# EAGLE design businesscard_board (EAGLE 9.6.2)
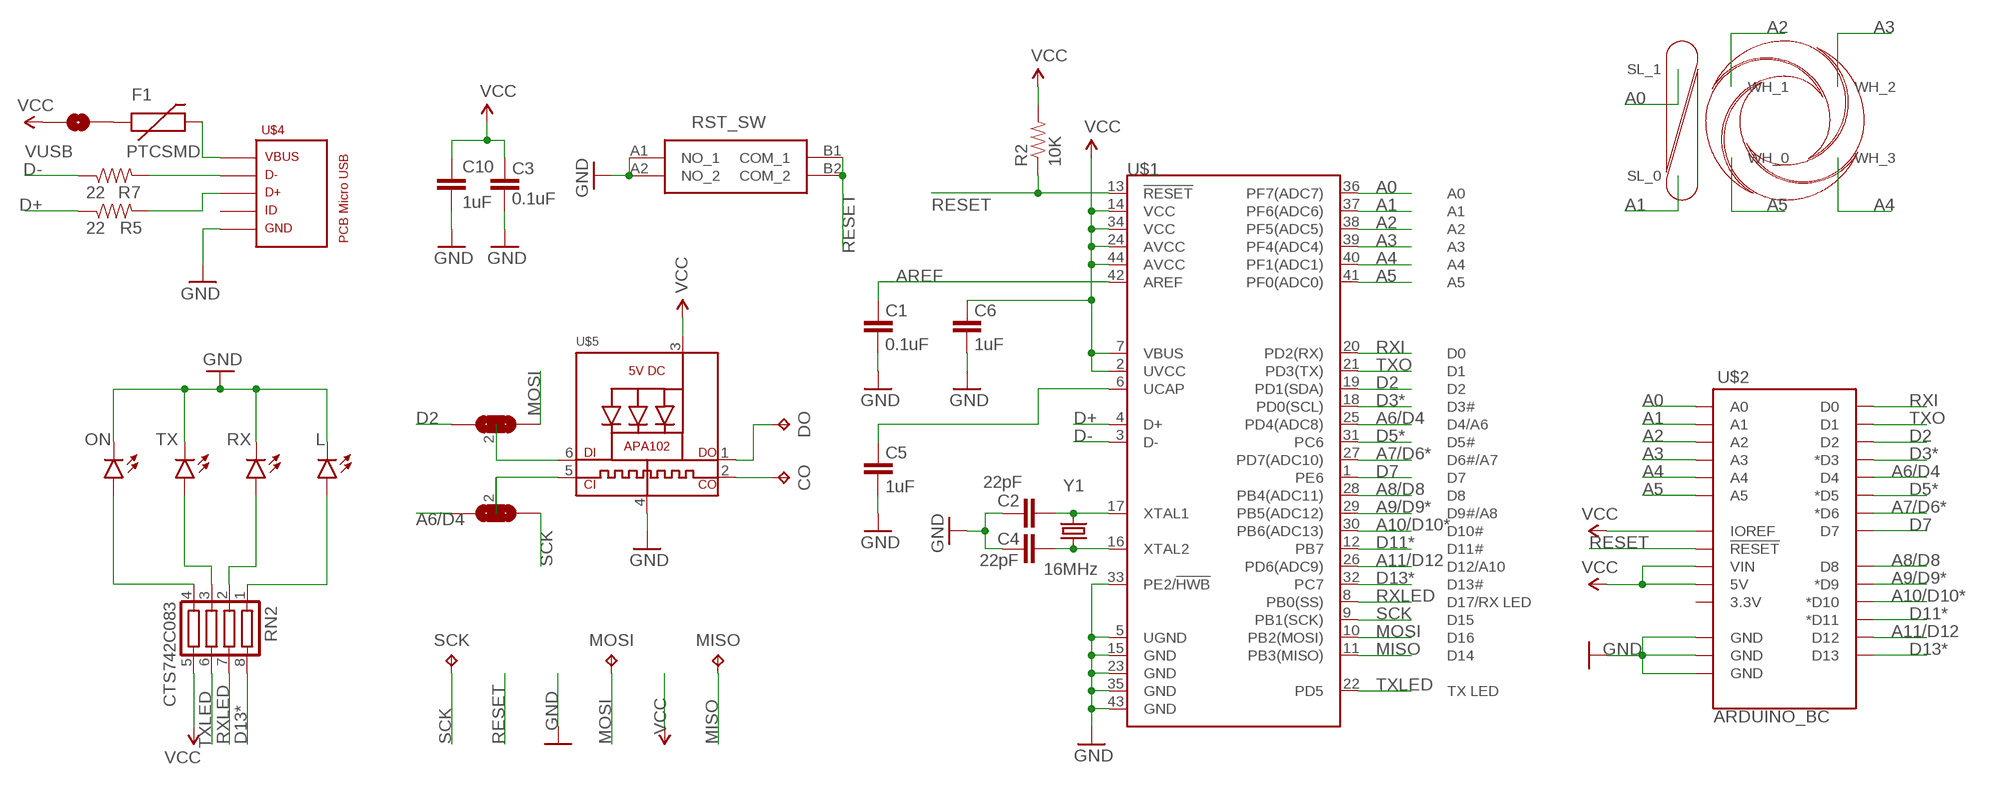
[diagram p0: schematic, sheet 1]

## Parts
C1  0.1uF  CAP0603-CAP  [0603-CAP]
C2  22pF  CAP0603-CAP  [0603-CAP]
C3  0.1uF  CAP0603-CAP  [0603-CAP]
C4  22pF  CAP0603-CAP  [0603-CAP]
C5  1uF  CAP0603-CAP  [0603-CAP]
C6  1uF  CAP0603-CAP  [0603-CAP]
C10  1uF  CAP0603-CAP  [0603-CAP]
CO  TPTP12R  [TP12R]
D2-/-°-MOSI  SOLDER_JP_3WAY  [SOLDER_JP_3WAY]
D4-/-°-SCK  SOLDER_JP_3WAY  [SOLDER_JP_3WAY]
DO  TPTP12R  [TP12R]
F1  PTCSMD  [PTC-1206]
L  LED  [LED-0603_NOMARKER]
MISO  TPTP12R  [TP12R]
MOSI  TPTP12R  [TP12R]
ON  LED  [LED-0603_NOMARKER]
R2  10K  RESISTOR0603-RES  [0603-RES]
R5  22  RESISTOR0603-RES  [0603-RES]
R7  22  RESISTOR0603-RES  [0603-RES]
RN2  CTS742C083  [CTS742C083]
RST_SW  EVP-BB0AAB000  [EVPBB0AAB000]
RX  LED  [LED-0603_NOMARKER]
SCK  TPTP12R  [TP12R]
TX  LED  [LED-0603_NOMARKER]
U$1  32U4  ATMEGA32U4  [TQFP44_QRCODE]
U$2  ARDUINO_BC  [ARDUINO_BC_SINGLEROWS]
U$3  TOUCH_SENSORS  [TOUCH_SENSORS]
U$4  PCB_MICRO_USB_B  [USB_TYPE_B_SS_2_NO_DIMENSION]
U$5  APA1022020  [APA102_2020]
VUSB  SOLDER_JP  [SOLDER_JP]
Y1  16MHz  CRYSTAL5X3  [CRYSTAL-SMD-5X3]

## Nets
A0 [vcc]: U$1.36(PF7(ADC7)) U$2.A0 U$3.SLIDER_1(SL_1)
A1: U$1.37(PF6(ADC6)) U$2.A1 U$3.SLIDER_0(SL_0)
A2: U$1.38(PF5(ADC5)) U$2.A2 U$3.WHEEL_1(WH_1)
A3: U$1.39(PF4(ADC4)) U$2.A3 U$3.WHEEL_2(WH_2)
A4: U$1.40(PF1(ADC1)) U$2.A4 U$3.WHEEL_3(WH_3)
A5: U$1.41(PF0(ADC0)) U$2.A5 U$3.WHEEL_0(WH_0)
A6/D4: D4-/-°-SCK.3(DIS) U$1.25(PD4(ADC8)) U$2.D4
A7/D6*: U$1.27(PD7(ADC10)) U$2.D6(*D6)
A8/D8: U$1.28(PB4(ADC11)) U$2.D8
A9/D9*: U$1.29(PB5(ADC12)) U$2.D9(*D9)
A10/D10*: U$1.30(PB6(ADC13)) U$2.D10(*D10)
A11/D12: U$1.26(PD6(ADC9)) U$2.D12
APA102_CI: D4-/-°-SCK.2(MID) U$5.5(CKI)
APA102_CO: CO.TP U$5.2(CKO)
APA102_DO: DO.TP U$5.1(DO)
AREF: C1.2 U$1.42(AREF)
D2: D2-/-°-MOSI.3(DIS) U$1.19(PD1(SDA)) U$2.D2
D3*: U$1.18(PD0(SCL)) U$2.D3(*D3)
D5*: U$1.31(PC6) U$2.D5(*D5)
D7: U$1.1(PE6) U$2.D7
D11*: U$1.12(PB7) U$2.D11(*D11)
D13*: RN2.8 U$1.32(PC7) U$2.D13
D+: R5.1 U$1.4(D+)
D-: R7.1 U$1.3(D-)
GND [vcc]: C1.1 C2.2 C3.1 C4.2 C5.1 C6.1 C10.2 L.C ON.C RST_SW.A1(NO_1) RST_SW.A2(NO_2) RX.C TX.C U$1.5(UGND) U$1.15(GND) U$1.23(GND) U$1.33(PE2/!HWB) U$1.35(GND) U$1.43(GND) U$2.GND@1(GND) U$2.GND@2(GND) U$2.GND@3(GND) U$4.5 U$5.4(GND)
MISO: MISO.TP U$1.11(PB3(MISO))
MOSI: D2-/-°-MOSI.1(CON) MOSI.TP U$1.10(PB2(MOSI))
N$1: ON.A RN2.4
N$2: RN2.3 TX.A
N$3: L.A RN2.1
N$4: RN2.2 RX.A
N$5: F1.1 VUSB.2
N$6: D2-/-°-MOSI.2(MID) U$5.6(DI)
N$13: C4.1 U$1.16(XTAL2) Y1.1
N$14: C2.1 U$1.17(XTAL1) Y1.3
N$15: C5.2 U$1.6(UCAP)
N$18: R7.2 U$4.2
N$19: R5.2 U$4.3
RESET: R2.1 RST_SW.B1(COM_1) RST_SW.B2(COM_2) U$1.13(!RESET) U$2.RESET@1(!RESET!)
RXI: U$1.20(PD2(RX)) U$2.D0
RXLED: RN2.7 U$1.8(PB0(SS))
SCK: D4-/-°-SCK.1(CON) SCK.TP U$1.9(PB1(SCK))
TXLED: RN2.6 U$1.22(PD5)
TXO: U$1.21(PD3(TX)) U$2.D1
USB_PWR: F1.2 U$4.1
VCC: C3.2 C6.2 C10.1 R2.2 RN2.5 U$1.2(UVCC) U$1.7(VBUS) U$1.14(VCC) U$1.24(AVCC) U$1.34(VCC) U$1.44(AVCC) U$2.5V U$2.5V@2(VIN) U$2.IOREF U$5.3(VDD) VUSB.1
Unconnected: U$2.NC(3.3V) U$2.NC@2(3.3V) U$4.4

## Library data of the parts
C1-C6 C10 = businesscard_board:CAP: Capacitor Standard 0603 ceramic capacitor, and 0.1" leaded capacitor.
CO DO MISO MOSI SCK = businesscard_board:TP: Test pad
D2-/-°-MOSI D4-/-°-SCK = businesscard_board:SOLDER_JP_3WAY
F1 = businesscard_board:PTC: Resettable Fuse PTC Resettable Fuse. Spark Fun Electronics SKU : COM-08357
L ON RX TX = businesscard_board:LED: LED (Generic) Standard schematic elements and footprints for 5mm, 3mm, 1206, and 0603 sized LEDs. Generic LEDs with no color specified.; PROD_ID: DIO-08794
R2 R5 R7 = businesscard_board:RESISTOR: Resistor Basic schematic elements and footprints for 0603, 1206, and PTH resistors.
RN2 = businesscard_board:CTS742C083: Chip Resistor Array 4 Single Resistor Source: http://www.ctscorp.com/components/Datasheets/CTSChipArrayDs.pdf; OC_FARNELL: unknown; OC_NEWARK: unknown
RST_SW = businesscard_board:EVP-BB0AAB000: Tactile Switches 2.6x1.6x0.5mm 0.7N 0.08mm Travel Source: Datasheet <https://componentsearchengine.com/Datasheets/1/EVP-BB0AAB000.pdf>; DESCRIPTION: Tactile Switches 2.6x1.6x0.5mm 0.7N 0.08mm Travel; HEIGHT: 0.6mm; MANUFACTURER_NAME: Panasonic; MANUFACTURER_PART_NUMBER: EVP-BB0AAB000; MOUSER_PART_NUMBER: 667-EVP-BB0AAB000; MOUSER_PRICE-STOCK: https://www.mouser.com/Search/Refine.aspx?Keyword=667-EVP-BB0AAB000
U$1 = businesscard_board:ATMEGA32U4: Atmel MCU, 32KByte Atmel 44-pin 8-bit Microcontroller with 32KBytes of ISP Flash and USB Controller Datasheet <http://cdn.sparkfun.com/datasheets/Dev/Arduino/Boards/ATMega32U4.pdf> SparkFun Products LilyPad Arduino USB - ATmega32U4 Board <https://www.sparkfun.com/products/12049> (DEV-12049) Pro Micro - 5V/16MHz <https://www.sparkfun.com/products/12640> (DEV-12640) Pro Micro - 3.3V/8MHz <https://www.sparkfun.com/products/12587> (DEV-12587) Fio v3 - ATmega32U4 <https://www.sparkfun.com/products/11520> (DEV-11520) Qduino Mini <https://www.sparkfun.com/products/13614> (DEV-13614) Makey Makey - Standard Kit <https://www.sparkfun.com/products/11511> (WIG-11511) Makey Makey Deluxe Kit <https://www.sparkfun.com/products/11519> (WIG-11519); PROD_ID: IC-11161
U$2 = businesscard_board:ARDUINO_BC
U$3 = businesscard_board:TOUCH_SENSORS
U$4 = businesscard_board:PCB_MICRO_USB_B
U$5 = businesscard_board:APA102: APA102/DotStar Pixels VCC: 5V DC Refresh Rate: 400Hz
VUSB = businesscard_board:SOLDER_JP
Y1 = businesscard_board:CRYSTAL: Crystals Various standard crystals. Proven footprints. Spark Fun Electronics SKU : COM-00534

## Board
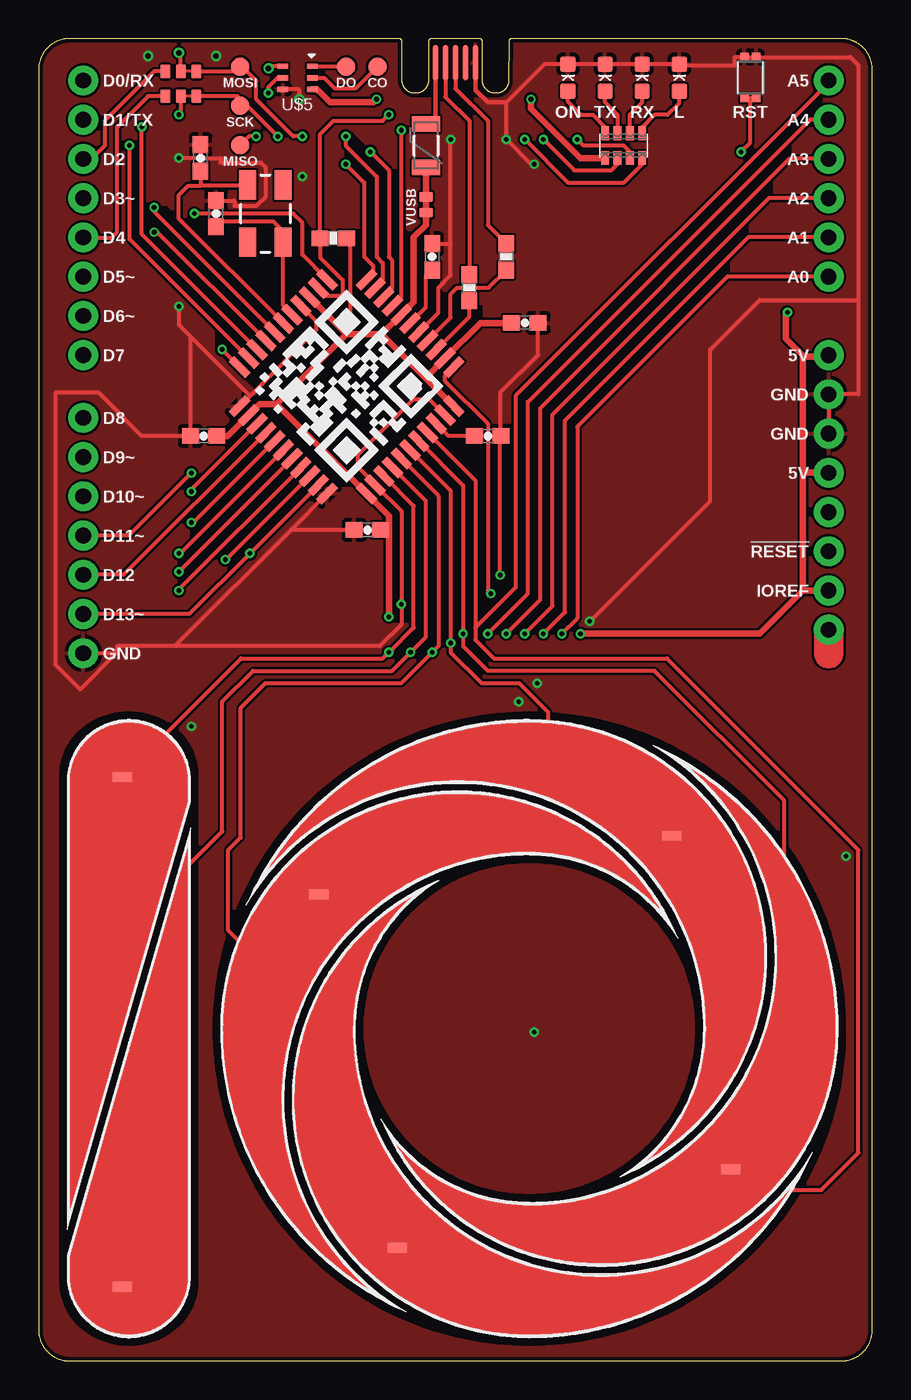
[diagram p1: board, top side]
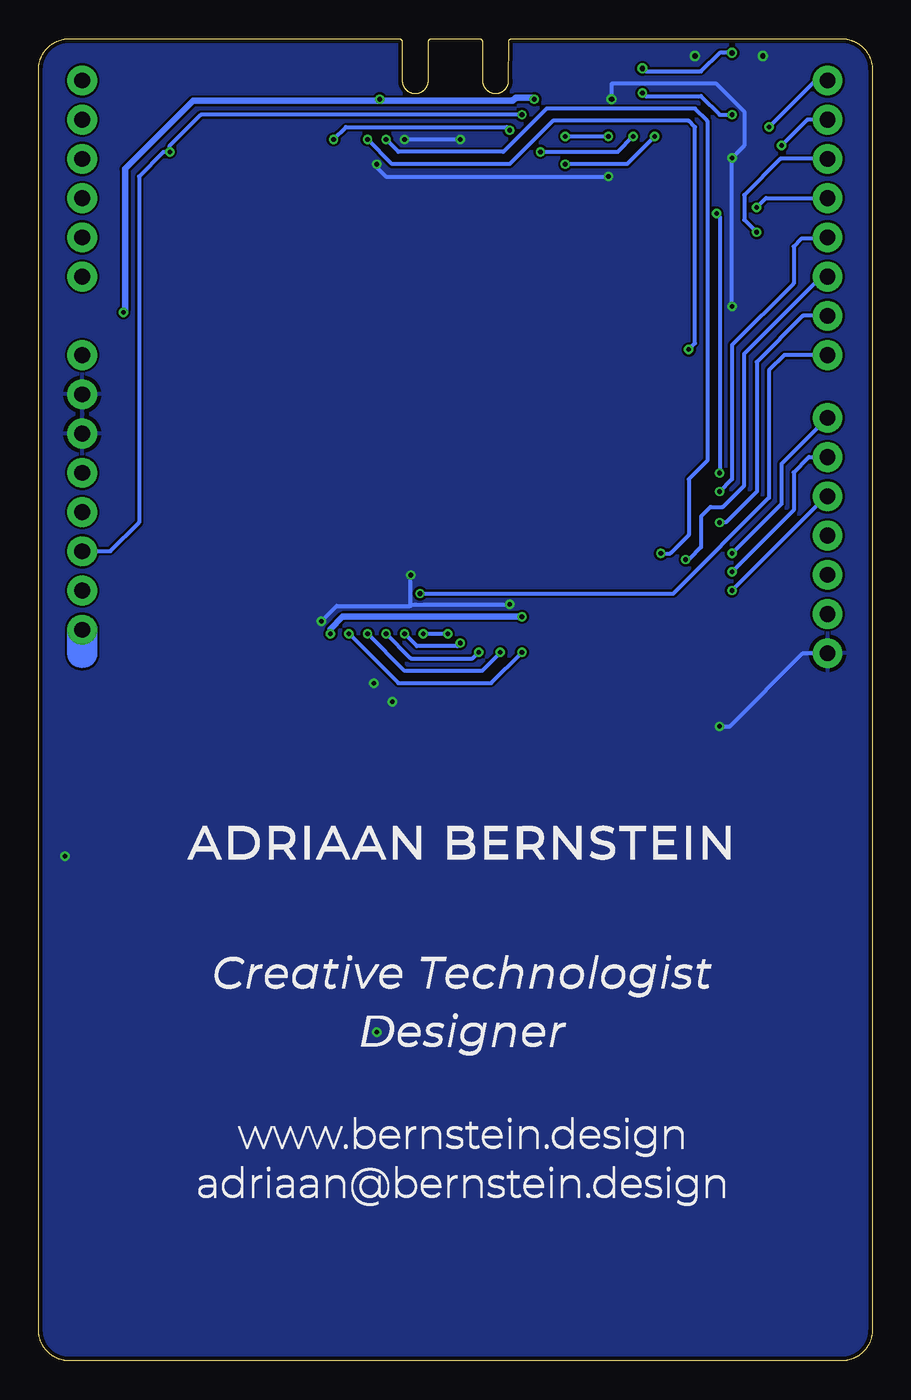
[diagram p2: board, bottom side, seen from below]

Size 53.98 x 85.6 mm. Coordinates in mm from the lower left corner, seen from the top.
Outline: 51.98,85.6 30.63,85.6 30.63,85.6 30.62,85.6 30.62,85.6 30.61,85.6 30.61,85.6 30.6,85.6 30.6,85.6 30.59,85.59 30.59,85.59 30.58,85.59 30.58,85.59 30.58,85.59 30.57,85.59 30.57,85.59 30.56,85.58 30.56,85.58 30.55,85.58 30.55,85.58 30.54,85.58 30.54,85.57 30.54,85.57 30.53,85.57 30.53,85.57 30.52,85.56 30.52,85.56 30.52,85.56 30.51,85.55 30.51,85.55 30.51,85.55 30.5,85.54 30.5,85.54 30.49,85.54 30.49,85.53 30.49,85.53 30.49,85.53 30.48,85.52 30.48,85.52 30.48,85.52 30.47,85.51 30.47,85.51 30.47,85.5 30.47,85.5 30.46,85.49 30.46,85.49 30.46,85.49 30.46,85.48 30.46,85.48 30.45,85.47 30.45,85.47 30.45,85.46 30.45,85.46 30.45,85.45 30.45,85.45 30.44,85.44 30.44,85.44 30.44,85.43 30.44,85.43 30.44,85.42 30.44,85.42 30.44,85.41 30.44,85.41 30.44,85.4 30.44,82.88 30.44,82.86 30.44,82.83 30.44,82.81 30.43,82.79 30.43,82.77 30.43,82.75 30.42,82.73 30.42,82.71 30.41,82.69 30.41,82.67 30.4,82.65 30.39,82.63 30.39,82.61 30.38,82.59 30.37,82.57 30.36,82.55 30.36,82.53 30.35,82.51 30.34,82.49 30.33,82.48 30.32,82.46 30.31,82.44 30.29,82.42 30.28,82.41 30.27,82.39 30.26,82.37 30.25,82.36 30.23,82.34 30.22,82.33 30.2,82.31 30.19,82.3 30.18,82.28 30.16,82.27 30.15,82.26 30.13,82.24 30.11,82.23 30.1,82.22 30.08,82.21 30.06,82.19 30.05,82.18 30.03,82.17 30.01,82.16 29.99,82.15 29.98,82.14 29.96,82.13 29.94,82.12 29.92,82.12 29.9,82.11 29.88,82.1 29.86,82.09 29.84,82.09 29.82,82.08 29.8,82.08 29.78,82.07 29.76,82.07 29.74,82.06 29.72,82.06 29.7,82.06 29.68,82.05 29.65,82.05 29.63,82.05 29.61,82.05 29.59,82.05 29.57,82.05 29.55,82.05 29.52,82.05 29.5,82.05 29.48,82.06 29.46,82.06 29.44,82.06 29.42,82.07 29.4,82.07 29.38,82.08 29.36,82.08 29.34,82.09 29.32,82.09 29.3,82.1 29.28,82.11 29.26,82.12 29.24,82.12 29.22,82.13 29.2,82.14 29.18,82.15 29.17,82.16 29.15,82.17 29.13,82.18 29.11,82.19 29.1,82.21 29.08,82.22 29.06,82.23 29.05,82.24 29.03,82.26 29.02,82.27 29,82.28 28.99,82.3 28.97,82.31 28.96,82.33 28.95,82.34 28.93,82.36 28.92,82.37 28.91,82.39 28.9,82.41 28.88,82.42 28.87,82.44 28.86,82.46 28.85,82.48 28.84,82.49 28.83,82.51 28.82,82.53 28.81,82.55 28.81,82.57 28.8,82.59 28.79,82.61 28.78,82.63 28.78,82.65 28.77,82.67 28.77,82.69 28.76,82.71 28.76,82.73 28.75,82.75 28.75,82.77 28.75,82.79 28.74,82.81 28.74,82.83 28.74,82.86 28.74,82.88 28.74,85.4 28.74,85.41 28.74,85.41 28.74,85.42 28.74,85.42 28.74,85.43 28.74,85.43 28.74,85.44 28.73,85.44 28.73,85.45 28.73,85.45 28.73,85.46 28.73,85.46 28.73,85.47 28.73,85.47 28.72,85.48 28.72,85.48 28.72,85.49 28.72,85.49 28.72,85.49 28.71,85.5 28.71,85.5 28.71,85.51 28.71,85.51 28.7,85.52 28.7,85.52 28.7,85.52 28.69,85.53 28.69,85.53 28.69,85.53 28.68,85.54 28.68,85.54 28.68,85.54 28.67,85.55 28.67,85.55 28.67,85.55 28.66,85.56 28.66,85.56 28.66,85.56 28.65,85.57 28.65,85.57 28.64,85.57 28.64,85.57 28.63,85.58 28.63,85.58 28.63,85.58 28.62,85.58 28.62,85.58 28.61,85.59 28.61,85.59 28.6,85.59 28.6,85.59 28.59,85.59 28.59,85.59 28.58,85.59 28.58,85.6 28.57,85.6 28.57,85.6 28.57,85.6 28.56,85.6 28.55,85.6 28.55,85.6 28.54,85.6 25.43,85.6 25.43,85.6 25.42,85.6 25.42,85.6 25.41,85.6 25.41,85.6 25.4,85.6 25.4,85.6 25.39,85.59 25.39,85.59 25.38,85.59 25.38,85.59 25.38,85.59 25.37,85.59 25.37,85.59 25.36,85.58 25.36,85.58 25.35,85.58 25.35,85.58 25.34,85.58 25.34,85.57 25.34,85.57 25.33,85.57 25.33,85.57 25.32,85.56 25.32,85.56 25.32,85.56 25.31,85.55 25.31,85.55 25.31,85.55 25.3,85.54 25.3,85.54 25.29,85.54 25.29,85.53 25.29,85.53 25.29,85.53 25.28,85.52 25.28,85.52 25.28,85.52 25.27,85.51 25.27,85.51 25.27,85.5 25.27,85.5 25.26,85.49 25.26,85.49 25.26,85.49 25.26,85.48 25.26,85.48 25.25,85.47 25.25,85.47 25.25,85.46 25.25,85.46 25.25,85.45 25.25,85.45 25.24,85.44 25.24,85.44 25.24,85.43 25.24,85.43 25.24,85.42 25.24,85.42 25.24,85.41 25.24,85.41 25.24,85.4 25.24,82.88 25.24,82.86 25.24,82.83 25.24,82.81 25.23,82.79 25.23,82.77 25.23,82.75 25.22,82.73 25.22,82.71 25.21,82.69 25.21,82.67 25.2,82.65 25.19,82.63 25.19,82.61 25.18,82.59 25.17,82.57 25.16,82.55 25.16,82.53 25.15,82.51 25.14,82.49 25.13,82.48 25.12,82.46 25.11,82.44 25.09,82.42 25.08,82.41 25.07,82.39 25.06,82.37 25.05,82.36 25.03,82.34 25.02,82.33 25,82.31 24.99,82.3 24.98,82.28 24.96,82.27 24.95,82.26 24.93,82.24 24.91,82.23 24.9,82.22 24.88,82.21 24.86,82.19 24.85,82.18 24.83,82.17 24.81,82.16 24.79,82.15 24.78,82.14 24.76,82.13 24.74,82.12 24.72,82.12 24.7,82.11 24.68,82.1 24.66,82.09 24.64,82.09 24.62,82.08 24.6,82.08 24.58,82.07 24.56,82.07 24.54,82.06 24.52,82.06 24.5,82.06 24.48,82.05 24.45,82.05 24.43,82.05 24.41,82.05 24.39,82.05 24.37,82.05 24.35,82.05 24.32,82.05 24.3,82.05 24.28,82.06 24.26,82.06 24.24,82.06 24.22,82.07 24.2,82.07 24.18,82.08 24.16,82.08 24.14,82.09 24.12,82.09 24.1,82.1 24.08,82.11 24.06,82.12 24.04,82.12 24.02,82.13 24,82.14 23.98,82.15 23.97,82.16 23.95,82.17 23.93,82.18 23.91,82.19 23.9,82.21 23.88,82.22 23.86,82.23 23.85,82.24 23.83,82.26 23.82,82.27 23.8,82.28 23.79,82.3 23.77,82.31 23.76,82.33 23.75,82.34 23.73,82.36 23.72,82.37 23.71,82.39 23.7,82.41 23.68,82.42 23.67,82.44 23.66,82.46 23.65,82.48 23.64,82.49 23.63,82.51 23.62,82.53 23.61,82.55 23.61,82.57 23.6,82.59 23.59,82.61 23.58,82.63 23.58,82.65 23.57,82.67 23.57,82.69 23.56,82.71 23.56,82.73 23.55,82.75 23.55,82.77 23.55,82.79 23.54,82.81 23.54,82.83 23.54,82.86 23.54,82.88 23.54,85.4 23.54,85.41 23.54,85.41 23.54,85.42 23.54,85.42 23.54,85.43 23.54,85.43 23.54,85.44 23.53,85.44 23.53,85.45 23.53,85.45 23.53,85.46 23.53,85.46 23.53,85.47 23.53,85.47 23.52,85.48 23.52,85.48 23.52,85.49 23.52,85.49 23.52,85.49 23.51,85.5 23.51,85.5 23.51,85.51 23.51,85.51 23.5,85.52 23.5,85.52 23.5,85.52 23.49,85.53 23.49,85.53 23.49,85.53 23.48,85.54 23.48,85.54 23.48,85.54 23.47,85.55 23.47,85.55 23.47,85.55 23.46,85.56 23.46,85.56 23.46,85.56 23.45,85.57 23.45,85.57 23.44,85.57 23.44,85.57 23.43,85.58 23.43,85.58 23.43,85.58 23.42,85.58 23.42,85.58 23.41,85.59 23.41,85.59 23.4,85.59 23.4,85.59 23.39,85.59 23.39,85.59 23.38,85.59 23.38,85.6 23.37,85.6 23.37,85.6 23.37,85.6 23.36,85.6 23.35,85.6 23.35,85.6 23.34,85.6 1.95,85.6 1.9,85.6 1.85,85.59 1.8,85.59 1.74,85.58 1.69,85.58 1.65,85.57 1.6,85.56 1.55,85.55 1.5,85.54 1.45,85.52 1.4,85.51 1.36,85.49 1.31,85.48 1.27,85.46 1.22,85.44 1.18,85.42 1.13,85.4 1.09,85.38 1.05,85.36 1,85.33 0.96,85.31 0.92,85.28 0.88,85.26 0.84,85.23 0.8,85.2 0.76,85.17 0.73,85.14 0.69,85.11 0.65,85.08 0.62,85.05 0.59,85.01 0.55,84.98 0.52,84.94 0.49,84.91 0.46,84.87 0.43,84.83 0.4,84.8 0.37,84.76 0.34,84.72 0.31,84.68 0.29,84.64 0.26,84.59 0.24,84.55 0.22,84.51 0.2,84.47 0.18,84.42 0.16,84.38 0.14,84.33 0.12,84.29 0.1,84.24 0.09,84.19 0.08,84.15 0.06,84.1 0.05,84.05 0.04,84 0.03,83.95 0.02,83.9 0.02,83.85 0.01,83.8 0.01,83.75 0,83.7 0,83.65 0,1.95 0,1.9 0.01,1.85 0.01,1.79 0.02,1.74 0.02,1.69 0.03,1.65 0.04,1.6 0.05,1.55 0.06,1.5 0.08,1.45 0.09,1.4 0.1,1.36 0.12,1.31 0.14,1.27 0.16,1.22 0.18,1.18 0.2,1.13 0.22,1.09 0.24,1.05 0.26,1 0.29,0.96 0.31,0.92 0.34,0.88 0.37,0.84 0.4,0.8 0.43,0.76 0.46,0.73 0.49,0.69 0.52,0.65 0.55,0.62 0.59,0.59 0.62,0.55 0.65,0.52 0.69,0.49 0.73,0.46 0.76,0.43 0.8,0.4 0.84,0.37 0.88,0.34 0.92,0.31 0.96,0.29 1,0.26 1.05,0.24 1.09,0.22 1.13,0.2 1.18,0.18 1.22,0.16 1.27,0.14 1.31,0.12 1.36,0.1 1.4,0.09 1.45,0.08 1.5,0.06 1.55,0.05 1.6,0.04 1.65,0.03 1.69,0.02 1.74,0.02 1.8,0.01 1.85,0.01 1.9,0 1.95,0 52.03,0 52.08,0 52.13,0.01 52.18,0.01 52.23,0.02 52.28,0.02 52.33,0.03 52.38,0.04 52.43,0.05 52.48,0.06 52.53,0.08 52.57,0.09 52.62,0.1 52.67,0.12 52.71,0.14 52.76,0.16 52.8,0.18 52.85,0.2 52.89,0.22 52.93,0.24 52.98,0.26 53.02,0.29 53.06,0.31 53.1,0.34 53.14,0.37 53.18,0.4 53.21,0.43 53.25,0.46 53.29,0.49 53.32,0.52 53.36,0.55 53.39,0.59 53.43,0.62 53.46,0.65 53.49,0.69 53.52,0.73 53.55,0.76 53.58,0.8 53.61,0.84 53.64,0.88 53.66,0.92 53.69,0.96 53.71,1 53.74,1.05 53.76,1.09 53.78,1.13 53.8,1.18 53.82,1.22 53.84,1.27 53.86,1.31 53.87,1.36 53.89,1.4 53.9,1.45 53.92,1.5 53.93,1.55 53.94,1.6 53.95,1.65 53.96,1.69 53.96,1.74 53.97,1.79 53.97,1.85 53.98,1.9 53.98,1.95 53.98,83.65 53.98,83.7 53.97,83.75 53.97,83.8 53.96,83.85 53.96,83.9 53.95,83.95 53.94,84 53.93,84.05 53.92,84.1 53.9,84.15 53.89,84.19 53.87,84.24 53.86,84.29 53.84,84.33 53.82,84.38 53.8,84.42 53.78,84.47 53.76,84.51 53.74,84.55 53.71,84.59 53.69,84.64 53.66,84.68 53.64,84.72 53.61,84.76 53.58,84.8 53.55,84.83 53.52,84.87 53.49,84.91 53.46,84.94 53.43,84.98 53.39,85.01 53.36,85.05 53.32,85.08 53.29,85.11 53.25,85.14 53.21,85.17 53.18,85.2 53.14,85.23 53.1,85.26 53.06,85.28 53.02,85.31 52.98,85.33 52.93,85.36 52.89,85.38 52.85,85.4 52.8,85.42 52.76,85.44 52.71,85.46 52.67,85.48 52.62,85.49 52.57,85.51 52.53,85.52 52.48,85.54 52.43,85.55 52.38,85.56 52.33,85.57 52.28,85.58 52.23,85.58 52.18,85.59 52.13,85.59 52.08,85.6 52.03,85.6 51.98,85.6
Copper layers (1*16): Top 0.035mm / dielectric 1.5mm / Bottom 0.035mm
Design rules "default *": minimum track width 6mil, minimum drill 0.3mm, track to track 0.145796875mm, track to pad 0.145796875mm, pad to pad 0.145796875mm, via to via 0.145796875mm, smd to smd 0mil, copper to edge 10mil, drill to drill 6mil, minimum pad ring 10mil, minimum via ring 6mil, stop-mask expansion 2mil, vias tented up to drill 24mil, thermal gap 10mil
tRestrict: area 6.7,45.9 to 29.1,74.7; area 27.5,47.1 to 50.7,82.3; area 24.3,81.9 to 29.5,83.1; area 24.3,69.1 to 25.9,72.7; area 17.1,70.3 to 24.3,79.5

### Footprints (pad centres in the part's own frame; a part is rotated, then mirrored left to right if it is on the bottom)
0603-CAP = smd 1.1 x 1: 1 -0.85,0; 2 0.85,0
TP12R = smd 1.2 x 1.2: TP 0,0
SOLDER_JP_3WAY = smd 0.635 x 0.889: 1 -1.143,0; 2 -0.127,0; 3 0.873,0
PTC-1206 = smd 1 x 1.8: 1 -1.4,0; 2 1.4,0
LED-0603_NOMARKER = smd 1 x 1: A -0.877,0; C 0.877,0
0603-RES = smd 1.1 x 1: 1 -0.85,0; 2 0.85,0
CTS742C083 = smd 0.5 x 0.9: 1 -1.2,-0.8; 2 -0.4,-0.8; 3 0.4,-0.8; 4 1.2,-0.8; 5 1.2,0.8; 6 0.4,0.8; 7 -0.4,0.8; 8 -1.2,0.8
EVPBB0AAB000 = smd 0.55 x 0.55: A1 -1.325,0.375; A2 -1.325,-0.375; B1 1.325,0.375; B2 1.325,-0.375
TQFP44_QRCODE = smd 1.5 x 0.5: 1 -5.8,4; 2 -5.8,3.2; 3 -5.8,2.4; 4 -5.8,1.6; 5 -5.8,0.8; 6 -5.8,0; 7 -5.8,-0.8; 8 -5.8,-1.6; 9 -5.8,-2.4; 10 -5.8,-3.2; 11 -5.8,-4; 23 5.8,-4; 24 5.8,-3.2; 25 5.8,-2.4; 26 5.8,-1.6; 27 5.8,-0.8; 28 5.8,0; 29 5.8,0.8; 30 5.8,1.6; 31 5.8,2.4; 32 5.8,3.2; 33 5.8,4 | smd 0.5 x 1.5: 12 -4,-5.8; 13 -3.2,-5.8; 14 -2.4,-5.8; 15 -1.6,-5.8; 16 -0.8,-5.8; 17 0,-5.8; 18 0.8,-5.8; 19 1.6,-5.8; 20 2.4,-5.8; 21 3.2,-5.8; 22 4,-5.8; 34 4,5.8; 35 3.2,5.8; 36 2.4,5.8; 37 1.6,5.8; 38 0.8,5.8; 39 0,5.8; 40 -0.8,5.8; 41 -1.6,5.8; 42 -2.4,5.8; 43 -3.2,5.8; 44 -4,5.8
ARDUINO_BC_SINGLEROWS = drill 1.016 pad 1.93: 5V 3.81,-24.13; 5V@2 11.43,-24.13; A0 16.51,-24.13; A1 19.05,-24.13; A2 21.59,-24.13; A3 24.13,-24.13; A4 26.67,-24.13; A5 29.21,-24.13; D0 29.21,24.13; D1 26.67,24.13; D2 24.13,24.13; D3 21.59,24.13; D4 19.05,24.13; D5 16.51,24.13; D6 13.97,24.13; D7 11.43,24.13; D8 7.366,24.13; D9 4.826,24.13; D10 2.286,24.13; D11 -0.254,24.13; D12 -2.794,24.13; D13 -5.334,24.13; GND@1 6.35,-24.13; GND@2 8.89,-24.13; GND@3 -7.874,24.13; IOREF -3.81,-24.13; NC -6.35,-24.13; NC@2 1.27,-24.13; RESET@1 -1.27,-24.13
TOUCH_SENSORS = smd 1.27 x 0.635: SLIDER_0 -26.67,-16.51; SLIDER_1 -26.67,16.51; WHEEL_0 -8.89,-13.97; WHEEL_1 -13.97,8.89; WHEEL_2 8.89,12.7; WHEEL_3 12.7,-8.89
USB_TYPE_B_SS_2_NO_DIMENSION = smd 0.37 x 2.3: 1 -1.3,-1.55; 2 -0.65,-1.55; 3 0,-1.55; 4 0.65,-1.55; 5 1.3,-1.55
APA102_2020 = smd 0.7 x 0.35: 1 -0.95,-0.75; 2 -0.95,0; 3 -0.95,0.75; 4 0.95,0.75; 5 0.95,0; 6 0.95,-0.75
SOLDER_JP = smd 0.635 x 0.889: 1 -1.143,0; 2 -0.127,0
CRYSTAL-SMD-5X3 = smd 1.9 x 1.1: 1 -1.85,-1.15; 2 1.85,-1.15; 3 1.85,1.15; 4 -1.85,1.15

### Placement (x,y rotation side)
C1  29.08,59.87 180 top
C2  10.48,77.87 90 top
C3  10.68,59.87 0 top
C4  11.48,74.27 90 top
C5  25.48,71.47 270 top
C6  21.28,53.8 0 top
C10  31.48,67.2 0 top
CO  21.94,83.78 90 top
D2-/-°-MOSI  9.08,83.47 180 top
D4-/-°-SCK  9.08,81.87 180 top
DO  19.91,83.78 90 top
F1  25.08,78.67 90 top
L  41.48,83.07 90 top
MISO  13.05,78.7 90 top
MOSI  13.05,83.78 90 top
ON  34.28,83.07 90 top
R2  19.08,72.67 0 top
R5  30.28,71.47 90 top
R7  27.88,69.47 90 top
RN2  37.88,78.67 180 top
RST_SW  46.08,83.07 270 top
RX  39.08,83.07 90 top
SCK  13.05,81.24 90 top
TX  36.68,83.07 90 top
U$1  19.95,63.07 225 top
U$2  27.02,53.68 90 top
U$3  32.1,21.3 0 top
U$4  26.99,85.59 0 top
U$5  16.77,83.06 180 top
VUSB  25.08,75.47 90 top
Y1  14.68,74.27 90 top

### Tracks (layer width: path | path; a pad name or v marks a point on that pad's centre or on a via)
A0  (via drill 0.3 pad 0.6)
  Top 0.254: U$1.36 24.28,55.34 24.28,47.47 v22.68,45.87 22.28,45.47 13.1,45.47 U$3.SLIDER_1 | v33.88,47.07 34.88,48.07 34.88,60.47 44.6,70.19 U$2.A0
  Bottom 0.254: v33.88,47.07 30.68,43.87 24.68,43.87 v22.68,45.87
A1  (via drill 0.3 pad 0.6)
  Top 0.254: U$3.SLIDER_0 8.68,8.04 8.68,29.07 9.48,29.87 9.48,31.87 11.88,34.27 11.88,42.67 13.88,44.67 22.88,44.67 v24.08,45.87 25.08,46.87 25.08,55.68 U$1.37 | v32.68,47.07 34.08,48.47 34.08,60.87 45.94,72.73 U$2.A1
  Bottom 0.254: v32.68,47.07 30.28,44.67 25.28,44.67 v24.08,45.87
A2  (via drill 0.3 pad 0.6)
  Top 0.254: U$3.WHEEL_1 14.68,26.74 14.68,26.67 13.48,26.67 12.28,27.87 12.28,33.07 13.08,33.87 13.08,42.27 14.68,43.87 23.48,43.87 v25.48,45.87 25.88,46.27 25.88,56.01 U$1.38 | v31.48,47.07 33.28,48.87 33.28,61.27 47.28,75.27 U$2.A2
  Bottom 0.254: v31.48,47.07 29.88,45.47 25.88,45.47 v25.48,45.87
A3  (via drill 0.3 pad 0.6)
  Top 0.254: U$1.39 26.68,56.34 v26.68,46.47 26.68,45.87 28.68,43.87 31.12,43.87 32.99,42 32.99,40.4 39.39,34 U$3.WHEEL_2 | v30.28,47.07 32.48,49.27 32.48,61.67 48.62,77.81 U$2.A3
  Bottom 0.254: v30.28,47.07 29.48,46.27 26.88,46.27 v26.68,46.47
A4  (via drill 0.3 pad 0.6)
  Top 0.254: U$1.40 27.48,56.67 v27.48,47.07 27.48,46.27 29.08,44.67 39.88,44.67 48.28,36.27 48.28,15.89 U$3.WHEEL_3 | v29.08,47.07 31.68,49.67 31.68,62.07 49.96,80.35 U$2.A4
  Bottom 0.254: v29.08,47.07 v27.48,47.07
A5
  Top 0.254: U$3.WHEEL_0 25.63,7.33 28.28,4.67 41.48,4.67 43.88,7.07 44.68,7.07 48.68,11.07 50.68,11.07 53.08,13.47 53.08,33.07 40.68,45.47 29.48,45.47 28.28,46.67 28.28,47.47 | U$1.41 28.28,57 28.28,47.47 | 28.28,47.47 30.88,50.07 30.88,62.47 51.15,82.74 U$2.A5
A6/D4  (via drill 0.3 pad 0.6)
  Top 0.254: D4-/-°-SCK.3 7.08,81.87 5.08,79.87 5.08,73.07 4.68,72.67 2.95,72.67 U$2.D4 | U$1.25 9.88,56.4 v9.88,56.27
  Bottom 0.254: v9.88,56.27 9.08,57.07 9.08,65.74 5.08,69.74 5.08,72.14 4.55,72.67 2.95,72.67 U$2.D4
A7/D6*  (via drill 0.3 pad 0.6)
  Top 0.254: U$1.27 10.02,54.27 v9.88,54.27
  Bottom 0.254: v9.88,54.27 9.48,54.27 7.48,56.27 7.48,64.66 4.49,67.65 U$2.D6
A8/D8  (via drill 0.3 pad 0.6)
  Top 0.254: U$1.28 9.15,52.27 v9.08,52.27
  Bottom 0.254: v9.08,52.27 5.88,55.47 5.88,58.06 U$2.D8
A9/D9*  (via drill 0.3 pad 0.6)
  Top 0.254: U$1.29 v9.08,51.07
  Bottom 0.254: v9.08,51.07 5.08,55.07 5.08,57.52 4.09,58.51 U$2.D9
A10/D10*  (via drill 0.3 pad 0.6)
  Top 0.254: U$1.30 9.08,49.94 v9.08,49.87
  Bottom 0.254: U$2.D10 2.99,55.97 v9.08,49.87
A11/D12
  Top 0.254: U$1.26 5.51,50.89 U$2.D12
APA102_CI  (via drill 0.3 pad 0.6)
  Top 0.254: D4-/-°-SCK.2 9.21,80.8 v9.08,80.67 | v14.88,82.07 14.88,82.47 15.47,83.06 U$5.5
  Bottom 0.254: v14.88,82.07 14.68,81.87 11.08,81.87 9.88,80.67 v9.08,80.67
APA102_CO
  Top 0.254: CO.TP 20.56,82.4 19.16,82.4 18.49,83.06 U$5.2
APA102_DO
  Top 0.254: U$5.1 19.88,83.81 DO.TP
AREF
  Top 0.254: C1.2 26.54,59.87 U$1.42
D2  (via drill 0.3 pad 0.6)
  Top 0.254: U$1.19 7.69,73.07 v7.48,73.07 | U$2.D2 3.42,77.81 4.28,78.67 4.28,80.27 7.48,83.47 D2-/-°-MOSI.3
  Bottom 0.254: v7.48,73.07 8.28,73.87 8.28,75.47 5.94,77.81 U$2.D2
D3*  (via drill 0.3 pad 0.6)
  Top 0.254: U$1.18 7.55,74.34 7.48,74.41 v7.48,74.67
  Bottom 0.254: v7.48,74.67 6.88,75.27 U$2.D3
D5*  (via drill 0.3 pad 0.6)
  Top 0.254: v12.08,51.87 12.15,51.87 U$1.31
  Bottom 0.254: v12.08,51.87 11.88,51.87 11.08,52.67 11.08,54.67 10.48,55.27 9.68,55.27 8.28,56.67 8.28,65.2 3.29,70.19 U$2.D5
D7  (via drill 0.3 pad 0.6)
  Top 0.254: U$1.1 26.28,63.75 26.28,63.47 29.08,60.67 29.08,49.87 v29.28,49.67
  Bottom 0.254: v29.28,49.67 12.88,49.67 6.68,55.87 6.68,64.12 5.69,65.11 U$2.D7
D11*  (via drill 0.3 pad 0.6)
  Top 0.254: v10.08,74.27 16.48,74.27 17.08,73.68 17.08,71.6 U$1.12 | v9.88,57.47 5.84,53.43 U$2.D11
  Bottom 0.254: v10.08,74.27 9.88,74.07 v9.88,57.47
D13*  (via drill 0.3 pad 0.6)
  Top 0.254: RN2.8 39.08,77.47 37.88,76.27 34.28,76.27 v31.48,79.07 | U$2.D13 9.76,48.35 v13.68,52.27 v13.68,52.28 U$1.32
  Bottom 0.254: v13.68,52.27 13.08,52.27 11.88,53.47 11.88,57.07 10.68,58.27 10.68,80.27 11.48,81.07 21.08,81.07 23.88,78.27 30.68,78.27 v31.48,79.07
D+
  Top 0.254: U$1.4 26.68,67.54 26.68,69.07 27.08,69.47 29.13,69.47 R5.1
D-
  Top 0.254: U$1.3 27.88,67.61 R7.1
GND  (via drill 0.3 pad 0.6, 0.35)
  Top 0.254: U$1.15 17.97,67.31 17.97,66.75 13.69,62.47 | 13.69,62.47 U$1.23 | U$1.43 25.27,62.27 24.28,62.27 20.68,58.67 20.68,57.87 21.79,56.77 U$1.35 23.48,55.01 v23.48,48.97 23.48,47.67 22.08,46.27 8.88,46.27 | 9.88,66.27 9.08,67.07 v9.08,68.27 | 10.48,77.87 v9.08,77.87 | C2.2 10.48,77.87 | 53.08,68.67 53.08,83.87 52.56,84.4 RST_SW.A1 RST_SW.A2 45.08,84.4 45.08,83.87 41.56,83.87 L.C RX.C TX.C ON.C 32.76,83.95 30.28,81.47 v30.28,79.07 31.88,77.47 v32.08,77.47 | 53.08,68.67 53.08,62.57 U$2.GND@2 U$2.GND@1 | C10.2 32.33,65.12 29.88,62.67 29.88,59.92 C1.1 29.88,59.82 v29.88,50.87 | U$1.5 25.88,67.87 25.88,69.47 26.68,70.27 26.68,72.32 | v35.68,47.87 43.48,55.67 43.48,65.47 46.68,68.67 53.08,68.67 | C5.1 26.68,72.32 | C6.1 16.33,53.8 | 26.68,72.32 v26.68,79.07 | 9.88,66.27 9.83,66.22 C3.1 6.68,59.87 3.88,62.67 1.08,62.67 1.08,45.07 2.68,43.47 5.02,45.81 | 8.88,46.27 5.08,46.27 5.08,45.87 5.02,45.81 | U$1.23 | 10.48,77.87 11.78,77.87 11.78,77.57 14.38,77.57 14.68,77.27 14.68,75.34 14.11,74.77 12.68,74.77 12.68,75.07 12.63,75.12 C4.2 | 9.88,66.27 13.69,62.47 | 13.69,62.47 | U$2.GND@3 5.02,45.81 | U$1.33 16.33,53.8 | 16.33,53.8 8.88,46.35 8.88,46.27 | v16.88,81.67 16.88,82.25 16.82,82.31 U$5.4
  Top 0.305: 30.28,81.47 29.08,81.47 28.29,82.27 U$4.5
  Bottom 0.254: v9.08,68.27 v9.08,77.87 8.28,78.67 8.28,80.87 10.08,82.67 16.88,82.67 v16.88,81.67 | 29.88,48.97 v23.48,48.97 | v35.68,47.87 34.68,48.87 29.88,48.87 29.88,48.97 | v30.28,79.07 v26.68,79.07 | v9.88,41.07 9.23,41.07 4.49,45.81 U$2.GND@3 | 29.88,48.97 v29.88,50.87 | v32.08,77.47 32.08,77.27 31.48,76.67 v17.08,76.67 | v16.88,81.67
  other vias: 32.08,21.27 32.28,43.87 31.08,42.67 52.28,32.67 7.08,84.47 11.48,84.47
  pour Top: -0.52,85.87 54.68,85.87 54.68,-0.53 -0.52,-0.53
  pour Bottom: -0.52,86.27 54.68,86.27 54.68,-0.53 -0.52,-0.53
MISO  (via drill 0.3 pad 0.6)
  Top 0.254: U$1.11 21.68,70.47 21.68,70.87 21.08,71.47 21.08,76.27 v19.88,77.47 | v14.08,79.27 13.62,79.27 MISO.TP
  Bottom 0.254: v14.08,79.27 15.88,77.47 v19.88,77.47
MOSI  (via drill 0.3 pad 0.6)
  Top 0.254: U$1.10 22.28,69.93 22.28,71.07 21.88,71.47 21.88,76.67 19.88,78.67 v19.88,79.27 | v17.08,79.27 16.48,79.27 14.08,81.67 14.08,82.87 13.48,83.47 13.08,83.47 | D2-/-°-MOSI.1 13.08,83.47 | MOSI.TP 13.08,83.75 13.08,83.47
  Bottom 0.254: v19.88,79.27 v17.08,79.27
N$1
  Top 0.254: RN2.4 36.68,79.87 35.88,80.67 35.12,80.67 34.28,81.51 ON.A
N$2
  Top 0.254: RN2.3 37.48,80.67 36.68,81.47 TX.A
N$3
  Top 0.254: RN2.1 39.08,79.87 39.88,80.67 40.72,80.67 41.48,81.43 L.A
N$4
  Top 0.254: RN2.2 38.28,80.67 39.08,81.47 RX.A
N$5
  Top 0.406: F1.1 VUSB.2 25.08,73.57
N$6  (via drill 0.35)
  Top 0.254: U$5.6 15.02,83.81 v14.88,83.67 | D2-/-°-MOSI.2 9.21,84.55 v9.08,84.67
  Bottom 0.254: v9.08,84.67 9.88,84.67 11.08,83.47 14.68,83.47 v14.88,83.67
N$13
  Top 0.254: U$1.16 15.83,68.32 Y1.1 15.83,73.12 15.18,73.77 11.83,73.77 C4.1
N$14
  Top 0.254: 10.48,76.07 9.68,76.07 9.08,75.47 9.08,73.94 U$1.17 | Y1.3 13.48,76.07 10.48,76.07 | C2.1 10.48,76.07
N$15
  Top 0.254: U$1.6 25.08,68.2 25.08,70.22 C5.2
N$18
  Top 0.254: R7.2 27.88,80.27 26.34,81.82 U$4.2
N$19
  Top 0.254: R5.2 29.08,73.52 29.08,80.27 26.99,82.37 U$4.3
RESET  (via drill 0.3 pad 0.6)
  Top 0.254: U$1.13 18.57,68.97 19.58,68.97 19.68,69.07 19.68,69.97 18.23,71.42 R2.1 18.23,79.42 19.08,80.27 22.28,80.27 v22.68,80.67 | RST_SW.B2 RST_SW.B1 46.08,81.75 46.08,78.87 v45.48,78.27
  Bottom 0.254: v22.68,80.67 43.48,80.67 45.48,78.67 v45.48,78.27 45.88,78.27 47.48,76.67 47.48,54.27 49.34,52.41 U$2.RESET@1
RXI  (via drill 0.3 pad 0.6)
  Top 0.254: U$1.20 6.68,72.94 v6.68,79.87
  Bottom 0.254: v6.68,79.87 3.66,82.89 U$2.D0
RXLED  (via drill 0.3 pad 0.6)
  Top 0.254: U$1.8 23.48,68.87 v23.48,79.67 | v34.88,79.07 35.28,78.67 37.88,78.67 38.28,78.27 RN2.7
  Bottom 0.254: v34.88,79.07 34.08,79.87 23.68,79.87 v23.48,79.67
SCK  (via drill 0.3 pad 0.6)
  Top 0.254: U$1.9 22.88,69.4 22.88,71.27 22.68,71.47 22.68,77.07 v21.48,78.27 | D4-/-°-SCK.1 12.86,81.87 13.05,81.68 SCK.TP 13.51,81.24 v15.48,79.27
  Bottom 0.254: v21.48,78.27 16.48,78.27 v15.48,79.27
TXLED  (via drill 0.3 pad 0.6)
  Top 0.254: RN2.6 37.48,77.47 37.08,77.07 34.68,77.07 v32.68,79.07 | U$1.22 v11.89,65.47 v11.88,65.47
  Bottom 0.254: v11.88,65.47 11.48,65.87 11.48,79.87 11.88,80.27 20.68,80.27 23.48,77.47 31.08,77.47 v32.68,79.07
TXO  (via drill 0.3 pad 0.6)
  Top 0.254: U$1.21 5.88,72.61 v5.88,78.67
  Bottom 0.254: v5.88,78.67 4.2,80.35 U$2.D1
USB_PWR
  Top 0.254: 25.68,80.07 F1.2
  Top 0.305: U$4.1 25.68,80.07
VCC  (via drill 0.3 pad 0.6)
  Top 0.254: 20.18,66.47 20.18,72.42
  Top 0.406: 15.43,61.94 U$1.34 22.68,54.68 22.68,53.87 | 15.43,61.94 14.29,61.94 U$1.24 12.23,59.87 C3.2 | 22.21,66.47 U$1.7 24.28,68.54 24.28,72.73 25.08,73.53 VUSB.1 | 19.95,66.47 U$1.14 | 22.21,66.47 20.18,66.47 19.95,66.47 | 15.43,61.94 19.95,66.47 | 25.04,63.64 U$1.2 28.6,67.2 C10.1 | 22.21,66.47 25.04,63.64 | v35.08,47.07 46.68,47.07 49.48,49.87 | 49.48,65.07 48.38,66.17 48.38,67.77 v48.48,67.87 | 49.48,65.07 49.55,65 51.04,65 U$2.5V@2 | 49.48,65.07 49.48,57.47 | 49.48,57.47 49.48,49.87 | U$1.44 25.04,63.64 | 25.04,63.64 | RN2.5 35.08,77.87 31.88,81.07 v31.88,81.67 | 20.18,72.42 R2.2 | 19.95,66.47 | v22.68,48.17 22.68,53.87 | C6.2 22.61,53.8 22.68,53.87 | 49.48,49.87 U$2.IOREF | U$2.5V 49.5,57.49 49.48,57.47 | U$5.3 18.04,82.31 18.88,81.47 21.68,81.47 v21.88,81.67
  Bottom 0.406: v22.68,48.17 34.28,48.17 35.08,47.37 v35.08,47.07 | v21.88,81.67 21.98,81.77 23.08,81.77 23.28,81.57 31.78,81.57 v31.88,81.67 31.88,81.57 43.98,81.57 48.38,77.17 48.38,67.97 v48.48,67.87

### Text on the board
tNames: RST